# EAGLE design BLELink (EAGLE 6.5.0)
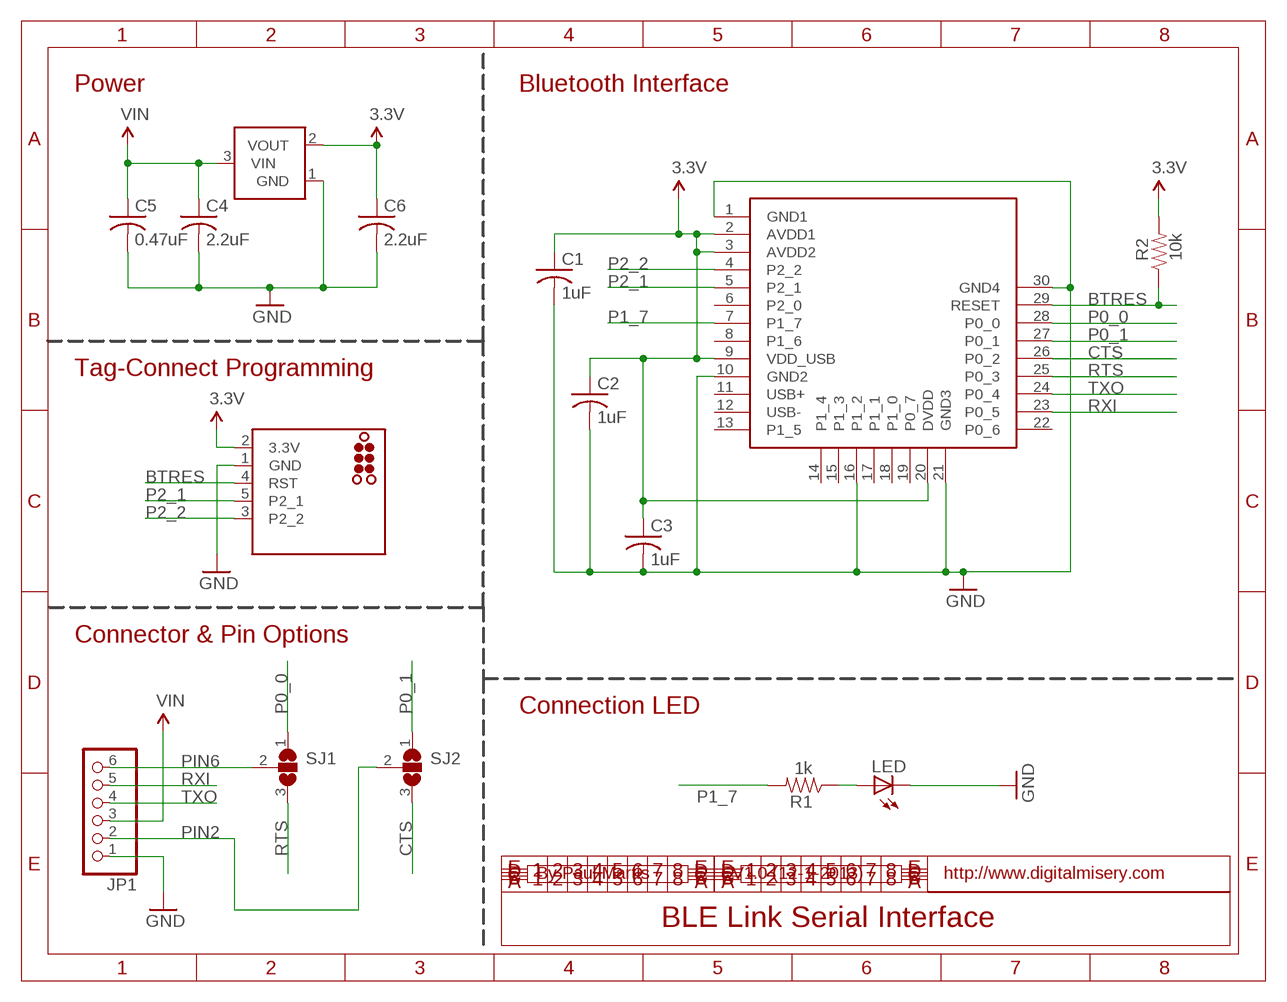
[diagram p0: schematic, sheet 1]

## Parts
C1  1uF  C-USC0805K  [C0805K]
C2  1uF  C-USC0805K  [C0805K]
C3  1uF  C-USC0805K  [C0805K]
C4  2.2uF  C-USC0805K  [C0805K]
C5  0.47uF  C-USC0805K  [C0805K]
C6  2.2uF  C-USC0805K  [C0805K]
J1  TC2030-CC-DEBUGGER  [TC2030-MCP-NL]
JP1  PINHD-1X6CB  [1X06-CLEANBIG]
LED  LEDCHIP-LED0805  [CHIP-LED0805]
R1  1k  RESISTOR0805-RES  [0805]
R2  10k  RESISTOR0805-RES  [0805]
SJ1  SJ2W  [SJ_2]
SJ2  SJ2W  [SJ_2]
U1  MCP1700  [SOT23-3]
U2  BLE112-A  [BLE112-A]

## Nets
3.3V: C1.1 C2.1 C3.1 C6.1 J1.2(3.3V) R2.2 U1.2(VOUT) U2.2(AVDD1) U2.3(AVDD2) U2.9(VDD_USB) U2.20(DVDD)
BTRES: J1.4(RST) R2.1 U2.29(RESET)
CTS: SJ2.3 U2.26(P0_2)
GND: C1.2 C2.2 C3.2 C4.2 C5.2 C6.2 J1.1(GND) JP1.1 LED.C U1.1(GND) U2.1(GND1) U2.10(GND2) U2.16(P1_2) U2.21(GND3) U2.30(GND4)
N$5: LED.A R1.1
P0_0: SJ1.1 U2.28(P0_0)
P0_1: SJ2.1 U2.27(P0_1)
P1_7: R1.2 U2.7(P1_7)
P2_1: J1.5(P2_1) U2.5(P2_1)
P2_2: J1.3(P2_2) U2.4(P2_2)
PIN2: JP1.2 SJ2.2
PIN6: JP1.6 SJ1.2
RTS: SJ1.3 U2.25(P0_3)
RXI: JP1.5 U2.23(P0_5)
TXO: JP1.4 U2.24(P0_4)
VIN: C4.1 C5.1 JP1.3 U1.3(VIN)
Unconnected: U2.6(P2_0) U2.8(P1_6) U2.11(USB+) U2.12(USB-) U2.13(P1_5) U2.14(P1_4) U2.15(P1_3) U2.17(P1_1) U2.18(P1_0) U2.19(P0_7) U2.22(P0_6)

## Notes on the sheet
- Power | Bluetooth Interface
- Tag-Connect Programming
- Connector & Pin Options
- Connection LED
- By Paul Martis | V1.0 (12-1-2013) | http://www.digitalmisery.com
- BLE Link Serial Interface

## Library data of the parts
C1-C6 = adafruit:C-US: CAPACITOR, American symbol
J1 = Tag-Connect:TC2030-CC-DEBUGGER: Arduino TAG-CONNECT ICSP Connector Manufacturer: Tag-Connect <http://www.tag-connect.com> Cable for easy Arduino In-Circuit Bootloader and Sketch Programming. PAD Description 1 MISO 2 VCC 3 SCK 4 MOSI 5 RST 6 GND ©2013 http://www.mkroll.mobi - modified and updated by Dr. Michael Kroll ‹dr.michael.kroll@gmail.com›
JP1 = adafruit:PINHD-1X6: PIN HEADER
LED = adafruit:LED: LED OSRAM: - CHIPLED LG R971, LG N971, LY N971, LG Q971, LY Q971, LO R971, LY R971 LH N974, LH R974 LS Q976, LO Q976, LY Q976 LO Q996 - Hyper CHIPLED LW Q18S LB Q993, LB Q99A, LB R99A - SideLED LS A670, LO A670, LY A670, LG A670, LP A670 LB A673, LV A673, LT A673, LW A673 LH A674 LY A675 LS A676, LA A676, LO A676, LY A676, LW A676 LS A679, LY A679, LG A679 - Hyper Micro SIDELED® LS Y876, LA Y876, LO Y876, LY Y876 LT Y87S - SmartLED LW L88C, LW L88S LB L89C, LB L89S, LG L890 LS L89K, LO L89K, LY L89K LS L896, LA L896, LO L896, LY L896 - TOPLED LS T670, LO T670, LY T670, LG T670, LP T670 LSG T670, LSP T670, LSY T670, LOP T670, LYG T670 LG T671, LOG T671, LSG T671 LB T673, LV T673, LT T673, LW T673 LH T674 LS T676, LA T676, LO T676, LY T676, LB T676, LH T676, LSB T676, LW T676 LB T67C, LV T67C, LT T67C, LS T67K, LO T67K, LY T67K, LW E67C LS E67B, LA E67B, LO E67B, LY E67B, LB E67C, LV E67C, LT E67C LW T67C LS T679, LY T679, LG T679 LS T770, LO T770, LY T770, LG T770, LP T770 LB T773, LV T773, LT T773, LW T773 LH T774 LS E675, LA E675, LY E675, LS T675 LS T776, LA T776, LO T776, LY T776, LB T776 LHGB T686 LT T68C, LB T68C - Hyper Mini TOPLED® LB M676 - Mini TOPLED Santana® LG M470 LS M47K, LO M47K, LY M47K Source: http://www.osram.convergy.de/
R1 R2 = SparkFun-Passives:RESISTOR: Resistor Basic schematic elements and footprints for 0603, 1206, and PTH resistors.
SJ1 SJ2 = jumper:SJ2W: SMD solder JUMPER
U1 = nonolith:MCP1700: Voltage regulator
U2 = SparkFun-RF:BLE112-A: BlueGiga Bluetooth 4.0 module with integrated chip antenna and onboard 8051 processor and peripherals

## Net classes
0 default: width 0.152 mm, drill 0.241 mm, clearance 0.152 mm

## Board
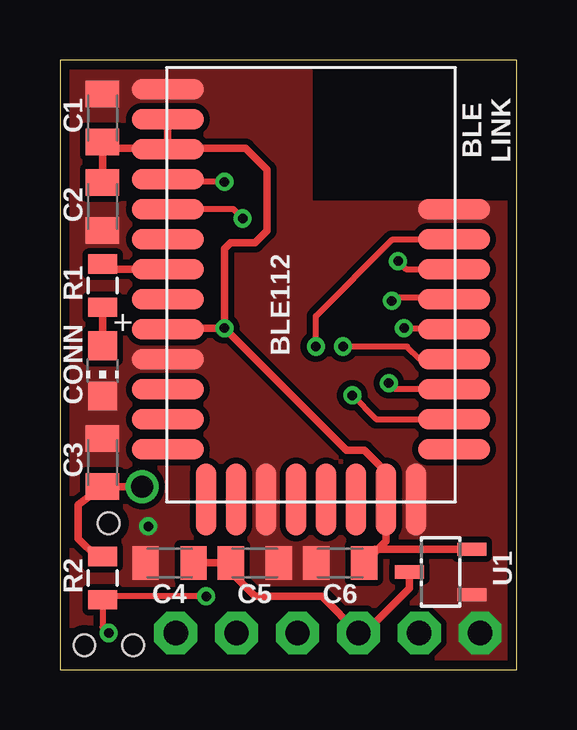
[diagram p1: board, top side]
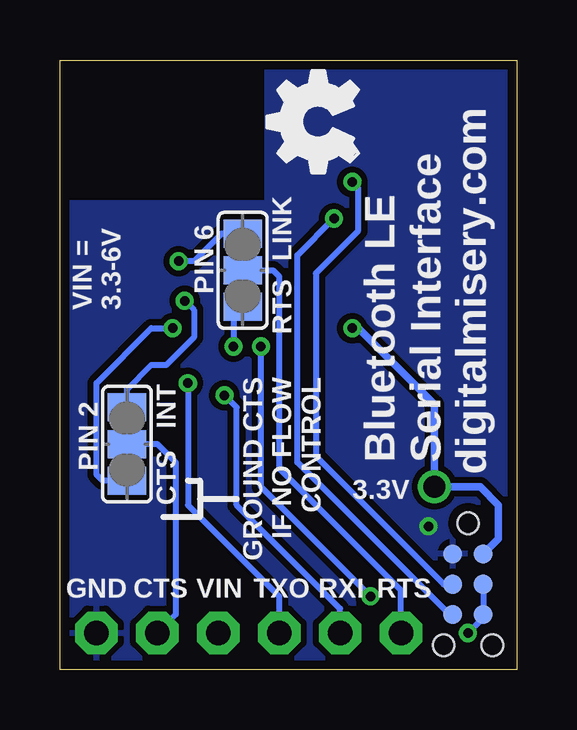
[diagram p2: board, bottom side, seen from below]

Size 19.05 x 25.4 mm. Coordinates in mm from the lower left corner, seen from the top.
Outline: 0,0 19.05,0 19.05,25.4 0,25.4 0,0
Copper layers (1*16): Top 0.0356mm / dielectric 1.5011mm / Bottom 0.0356mm
Design rules "LaenPCBOrder *": minimum track width 6mil, minimum drill 13mil, track to track 6mil, track to pad 6mil, pad to pad 6mil, via to via 6mil, smd to smd 6mil, copper to edge 15mil, drill to drill 6mil, minimum pad ring 7mil, minimum via ring 7mil, stop-mask expansion 3mil, vias tented up to drill 16mil, thermal gap 10mil

### Footprints (pad centres in the part's own frame; a part is rotated, then mirrored left to right if it is on the bottom)
C0805K = smd 1.1 x 1.4: 1 -1,0; 2 1,0
TC2030-MCP-NL = smd 0.787 x 0.787: 1 1.27,-0.635; 2 1.27,0.635; 3 2.54,-0.635; 4 2.54,0.635; 5 3.81,-0.635; 6 3.81,0.635 | hole 0.889: 0,0; 5.08,-1.016; 5.08,1.016
1X06-CLEANBIG = drill 1.016 pad 1.778 octagon: 1 -6.35,0; 2 -3.81,0; 3 -1.27,0; 4 1.27,0; 5 3.81,0; 6 6.35,0
CHIP-LED0805 = smd 1.2 x 1.2: A 0,-1.05; C 0,1.05
0805 = smd 0.8 x 1.2: 1 -0.9,0; 2 0.9,0
SJ_2 = smd 1.168 x 1.6: 1 -1.524,0; 2 0,0; 3 1.524,0
SOT23-3 = smd 0.55 x 1.2: 1 0.95,1.3; 2 -0.95,1.3; 3 0,-1.3
BLE112-A = smd 3 x 0.85: 1 0.05,17.2; 2 0.05,15.95; 3 0.05,14.7; 4 0.05,13.45; 5 0.05,12.2; 6 0.05,10.95; 7 0.05,9.7; 8 0.05,8.45; 9 0.05,7.2; 10 0.05,5.95; 11 0.05,4.7; 12 0.05,3.45; 13 0.05,2.2; 22 12,2.2; 23 12,3.45; 24 12,4.7; 25 12,5.95; 26 12,7.2; 27 12,8.45; 28 12,9.7; 29 12,10.95; 30 12,12.2 | smd 0.85 x 3: 14 1.65,0.1; 15 2.9,0.1; 16 4.15,0.1; 17 5.4,0.1; 18 6.65,0.1; 19 7.9,0.1; 20 9.15,0.1; 21 10.4,0.1

### Placement (x,y rotation side)
C1  1.78,22.99 90 top
C2  1.78,19.3 270 top
C3  1.78,8.64 90 top
C4  4.57,4.45 180 top
C5  8.13,4.45 0 top
C6  11.68,4.45 180 top
J1  2.03,6.1 270 bottom
JP1  11.18,1.52 180 top
LED  1.78,12.45 180 top
R1  1.78,16 90 top
R2  1.78,3.81 90 top
SJ1  11.43,16.64 270 bottom
SJ2  16.26,9.4 270 bottom
U1  15.88,4.06 270 top
U2  4.45,6.99 0 top
U$1  [OSHW_FILLX150_NOTEXT]  6.6,20.7 90 bottom

### Tracks (layer width: path | path; a pad name or v marks a point on that pad's centre or on a via)
3.3V  (via drill 0.4, 0.91)
  Top 0.305: U2.2 U2.3 4.45,21.73 | U1.2 13.14,5.01 12.7,4.57 12.7,4.08 C6.1 13.6,5.36 U2.20 13.72,7.21 13.72,8.13 12.7,9.14 11.94,9.14 v6.86,14.22 | C3.1 1.52,7.37 | U2.9 4.53,14.22 v6.86,14.22 | 4.45,21.73 7.73,21.73 8.64,20.83 8.64,18.29 8.13,17.78 7.11,17.78 6.86,17.53 v6.86,14.22 | C2.1 C1.1 1.78,21.73 4.45,21.73 | R2.2 1.52,4.7 0.76,5.46 0.76,6.87 C3.1 | v3.43,7.62 1.54,7.62 C3.1
  Bottom 0.305: 1.27,4.83 J1.2 0.76,5.46 0.76,6.86 1.52,7.62 v3.43,7.62 3.43,11.05 6.6,14.22 v6.86,14.22
BTRES  (via drill 0.4)
  Top 0.254: v6.1,3.05 1.52,3.05 R2.1 1.78,1.78 v2.03,1.52 | 16.29,17.78 16.16,17.91 13.84,17.91 10.67,14.73 v10.67,13.46
  Top 0.305: U2.29 16.29,17.78
  Bottom 0.254: v6.1,3.05 10.67,7.62 v10.67,13.46 | J1.4 1.4,2.16 v2.03,1.52
CTS  (via drill 0.4)
  Top 0.254: v14.35,14.22 16.41,14.22
  Top 0.305: U2.26 16.41,14.22
  Bottom 0.254: SJ2.3 17.27,7.87 17.53,8.13 17.53,11.94 15.24,14.22 v14.35,14.22
GND  (via drill 0.4)
  other vias: 3.68,5.97
  pour Bottom (isolate 0.254): 0,0 0,25.4 10.41,25.4 10.41,19.43 19.05,19.43 19.05,0
  pour Top (isolate 0.254, no thermals): 0,0 0,25.4 10.41,25.4 10.41,19.43 19.05,19.43 19.05,0
N$5
  Top 0.305: 1.4,14.97 R1.1 LED.A
P0_0  (via drill 0.4)
  Top 0.254: 16.4,16.64 U2.28 14.43,16.68 v14.1,17.02
  Bottom 0.254: SJ1.1 12.32,18.16 13.46,17.02 v14.1,17.02
P0_1  (via drill 0.4)
  Top 0.254: U2.27 16.39,15.49 13.97,15.49 v13.84,15.37
  Bottom 0.254: SJ2.1 16.26,11.68 15.24,12.7 14.61,12.7 13.46,13.84 13.46,14.99 v13.84,15.37
P1_7
  Top 0.305: 4.28,16.9 U2.7 1.74,16.68 R1.2
P2_1  (via drill 0.4)
  Top 0.254: v7.62,18.8 7.23,19.18 U2.5
  Bottom 0.254: J1.5 2.92,2.41 9.14,8.64 9.14,17.27 v7.62,18.8
P2_2  (via drill 0.4)
  Top 0.254: v6.86,20.32 4.61,20.32 U2.4
  Bottom 0.254: J1.3 3.05,3.56 8.38,8.89 8.38,16.51 6.6,18.29 6.6,20.07 v6.86,20.32
PIN2
  Bottom 0.254: JP1.2 14.22,2.29 14.22,8.64 14.99,9.4 SJ2.2
PIN6
  Bottom 0.254: SJ1.2 10.16,16.64 9.91,16.38 9.91,8.38 4.83,3.3 JP1.6
RTS  (via drill 0.4)
  Top 0.254: U2.25 15.01,12.94 14.48,13.46 v11.81,13.46
  Bottom 0.254: 11.68,15.24 SJ1.3 11.56,15.11 11.81,14.86 v11.81,13.46
RXI  (via drill 0.4)
  Top 0.254: U2.23 13.19,10.44 v12.19,11.43
  Bottom 0.254: JP1.5 7.37,2.54 11.68,6.86 11.68,10.92 v12.19,11.43
TXO  (via drill 0.4)
  Top 0.254: 15.24,11.69 13.97,11.69 v13.72,11.94
  Top 0.305: U2.24 15.24,11.69
  Bottom 0.254: JP1.4 9.91,3.05 13.72,6.86 v13.72,11.94
VIN
  Top 0.305: U1.3 14.57,3.4 12.7,1.52 JP1.3 10.92,3.05 8.13,3.05 7.13,4.05 C5.1 C4.1

### Text on the board
tPlace: BLE / LINK | BLE112 | CONN
bPlace: PIN 6 | LINK | VIN = / 3.3-6V | RTS | GROUND CTS / IF NO FLOW / CONTROL | PIN 2 | INT | Bluetooth LE / Serial Interface | digitalmisery.com | 3.3V | CTS | RTS | RXI | TXO | VIN | CTS | GND